# Altium schematic sheet MCU.SchDoc
size 320 x 193 mm
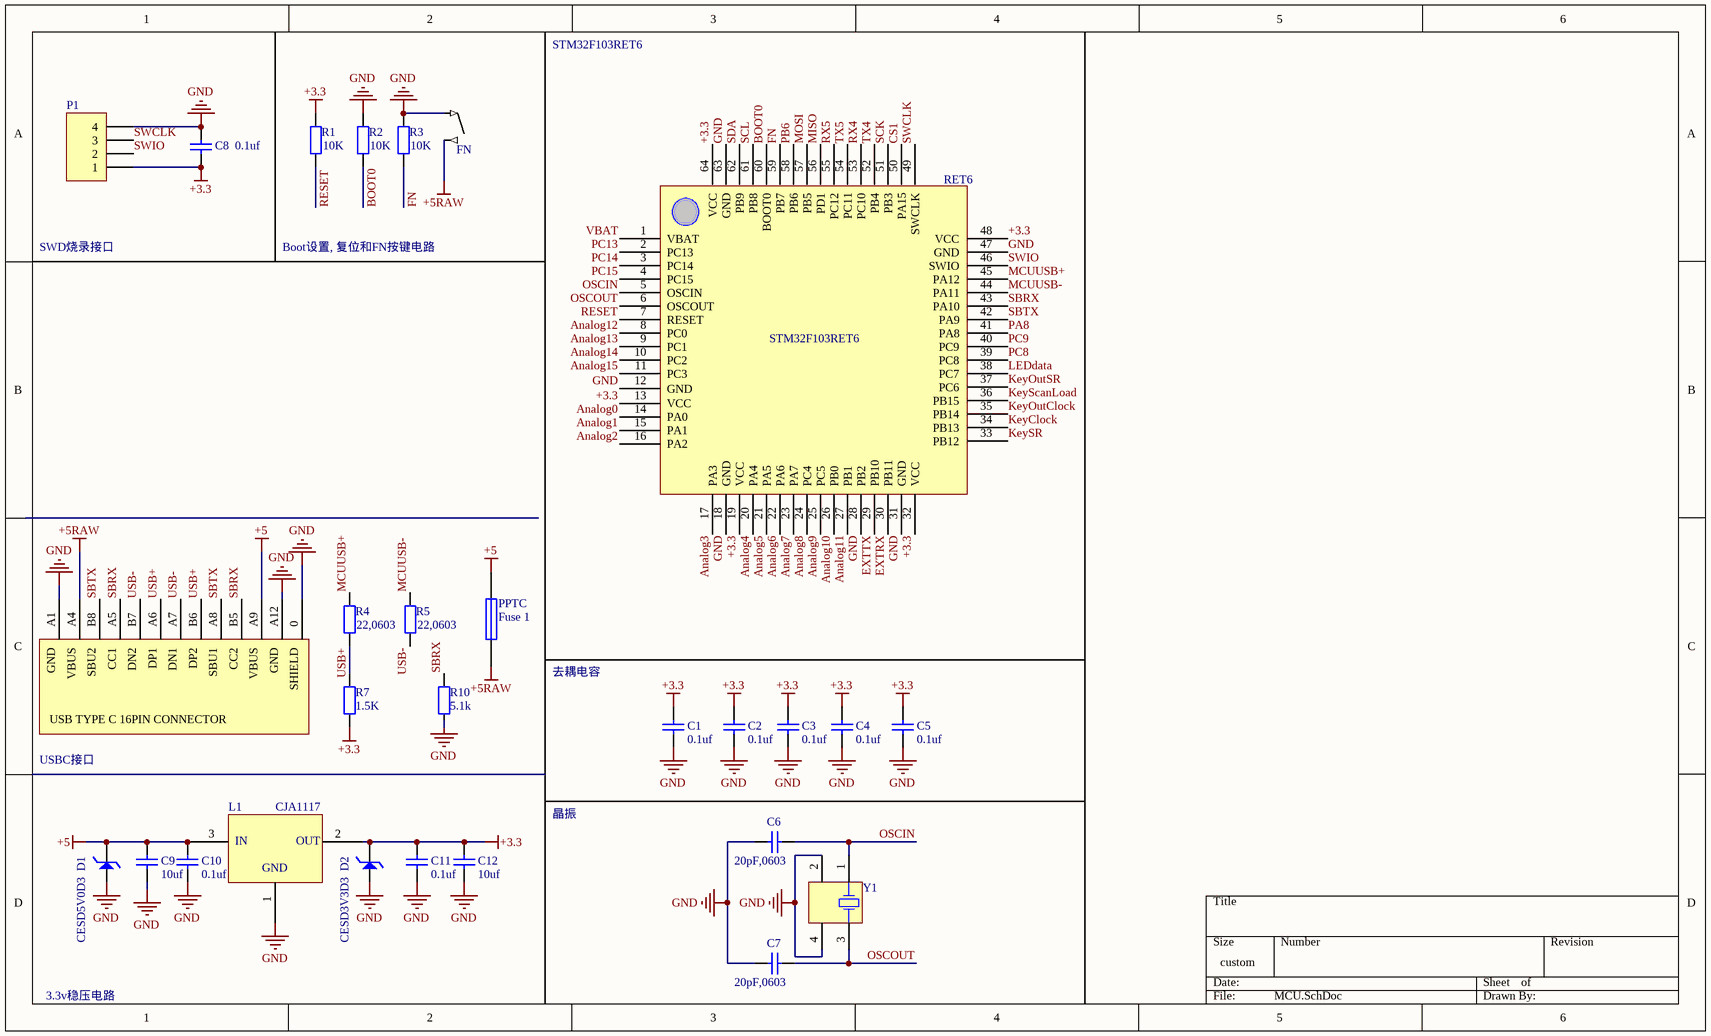
[diagram p0: MCU.SchDoc]

## Parts
1  System  [USBC 16PIN -1.6]  (value not drawn)
C1  value 0.1uf  [C1206]  (hidden comment: System)
C2  value 0.1uf  [C1206]  (hidden comment: System)
C3  value 0.1uf  [C1206]  (hidden comment: System)
C4  value 0.1uf  [C1206]  (hidden comment: System)
C5  value 0.1uf  [C1206]  (hidden comment: System)
C6  value 20pF,0603  [1608[0603]]  (hidden comment: System)
C7  value 20pF,0603  [1608[0603]]  (hidden comment: System)
C8  value 0.1uf  [C1206]  (hidden comment: System)
C9  value 10uf  [C1206]  (hidden comment: System)
C10  value 0.1uf  [C1206]  (hidden comment: System)
C11  value 0.1uf  [C1206]  (hidden comment: System)
C12  value 10uf  [C1206]  (hidden comment: System)
D1  CESD5V0D3  [SOD323]
D2  CESD3V3D3  [SOD323]
FN  System  [dome button]  (value not drawn)
L1  CJA1117  [SOT89-3L]
P1  System  [HDR1X4]  (value not drawn)
PPTC  Fuse 1  [C1206]
R1  value 10K  [C1206]  (hidden comment: System)
R2  value 10K  [C1206]  (hidden comment: System)
R3  value 10K  [C1206]  (hidden comment: System)
R4  value 22,0603  [1608[0603]]  (hidden comment: System)
R5  value 22,0603  [1608[0603]]  (hidden comment: System)
R7  value 1.5K  [0603]  (hidden comment: System)
R10  value 5.1k  [0603]  (hidden comment: System)
RET6  RET6  [STM-LQFP64_L]  (value not drawn)
Y1  System  [3225]  (value not drawn)

## Nets
+3.3: C1.2 C2.2 C3.2 C4.2 C5.2 C8.1 C11.2 C12.2 D2.2 L1.2 P1.1 R1.2 R7.2 RET6.13(VCC) RET6.19(VCC) RET6.32(VCC) RET6.48(VCC) RET6.64(VCC)
+5: 1.A9 C9.2 C10.2 D1.2 L1.3 PPTC.2
+5RAW: 1.A4 FN.2(Out) PPTC.1
GND: 1.0 1.A1 1.A12 C1.1 C2.1 C3.1 C4.1 C5.1 C6.1 C7.1 C8.2 C9.1 C10.1 C11.1 C12.1 FN.1 L1.1 P1.4 R2.2 R3.2 R10.2 RET6.12(GND) RET6.18(GND) RET6.28(PB2) RET6.31(GND) RET6.47(GND) RET6.63(GND) Y1.2(NC) Y1.4(NC)
Analog0: RET6.14(PA0)
Analog1: RET6.15(PA1)
Analog2: RET6.16(PA2)
Analog3: RET6.17(PA3)
Analog4: RET6.20(PA4)
Analog5: RET6.21(PA5)
Analog6: RET6.22(PA6)
Analog7: RET6.23(PA7)
Analog8: RET6.24(PC4)
Analog9: RET6.25(PC5)
Analog10: RET6.26(PB0)
Analog11: RET6.27(PB1)
Analog12: RET6.8(PC0)
Analog13: RET6.9(PC1)
Analog14: RET6.10(PC2)
Analog15: RET6.11(PC3)
BOOT0: R2.1 RET6.60(BOOT0)
CS1: RET6.50(PA15)
EXTRX: RET6.30(PB11)
EXTTX: RET6.29(PB10)
FN: R3.1 RET6.59(PB7)
KeyClock: RET6.34(PB13)
KeyOutClock: RET6.35(PB14)
KeyOutSR: RET6.37(PC6)
KeyScanLoad: RET6.36(PB15)
KeySR: RET6.33(PB12)
LEDdata: RET6.38(PC7)
MCUUSB+: R4.2 RET6.45(PA12)
MCUUSB-: R5.2 RET6.44(PA11)
MISO: RET6.56(PD1)
MOSI: RET6.57(PB5)
OSCIN: C6.2 RET6.5(OSCIN) Y1.1(OSC1)
OSCOUT: C7.2 RET6.6(OSCOUT) Y1.3(OSC2)
PA8: RET6.41(PA8)
PB6: RET6.58(PB6)
PC8: RET6.39(PC8)
PC9: RET6.40(PC9)
PC13: RET6.2(PC13)
PC14: RET6.3(PC14)
PC15: RET6.4(PC15)
RESET: R1.1 RET6.7(RESET)
RX4: RET6.53(PC10)
RX5: RET6.55(PC12)
SBRX: 1.A5 1.B5 R10.1 RET6.43(PA10)
SBTX: 1.A8 1.B8 RET6.42(PA9)
SCK: RET6.51(PB3)
SCL: RET6.61(PB8)
SDA: RET6.62(PB9)
SWCLK: P1.3 RET6.49(SWCLK)
SWIO: P1.2 RET6.46(SWIO)
TX4: RET6.52(PB4)
TX5: RET6.54(PC11)
USB+: 1.A6 1.B6 R4.1 R7.1
USB-: 1.A7 1.B7 R5.1
VBAT: RET6.1(VBAT)

Not connected (* = marked no-connect by the designer): D1 1; D2 1

## Notes on the sheet
- STM32F103RET6
- SWD烧录接口
- Boot设置, 复位和FN按键电路
- 去耦电容
- USBC接口
- 晶振
- 3.3v稳压电路
- Labels drawn without touching a wire or pin: GND
- (in symbol CJA1117) IN; OUT; GND
- (in symbol RET6) STM32F103RET6
- (in symbol USBC 16PIN) GND; VBUS; SBU2; CC1; DN2; DP1; DN1; DP2; SBU1; CC2; SHIELD; USB TYPE C 16PIN CONNECTOR

## Library data of the parts
1 = USBC 16PIN
C1-C12 = Cap: Published: 8-Jun-2000; LatestRevisionDate: 17-Jul-2002; LatestRevisionNote: Re-released for DXP Platform.; PackageReference: RAD-0.3; Publisher: Altium Limited; PackageDescription: Radial Cap, Thru-Hole; 2 Leads; 0.3 in Pin Spacing
D1 D2 = TVS
FN = SW
P1 = Header 4: LatestRevisionDate: 17-Jul-2002; LatestRevisionNote: Re-released for DXP Platform.; Publisher: Altium Limited
PPTC = Fuse 1: Fuse; Published: 8-Jun-2000; LatestRevisionDate: 17-Jul-2002; LatestRevisionNote: Re-released for DXP Platform.; PackageReference: PIN-W2/E2.8; Publisher: Altium Limited; PackageDescription: Thru-Hole; 2 Leads
R1-R5 R7 R10 = Res2: Published: 8-Jun-2000; LatestRevisionDate: 17-Jul-2002; LatestRevisionNote: Re-released for DXP Platform.; PackageReference: AXIAL-0.4; Publisher: Altium Limited; PackageDescription: Axial Device, Thru-Hole; 2 Leads; 0.4 in Pin Spacing
Y1 = 3225Crystal